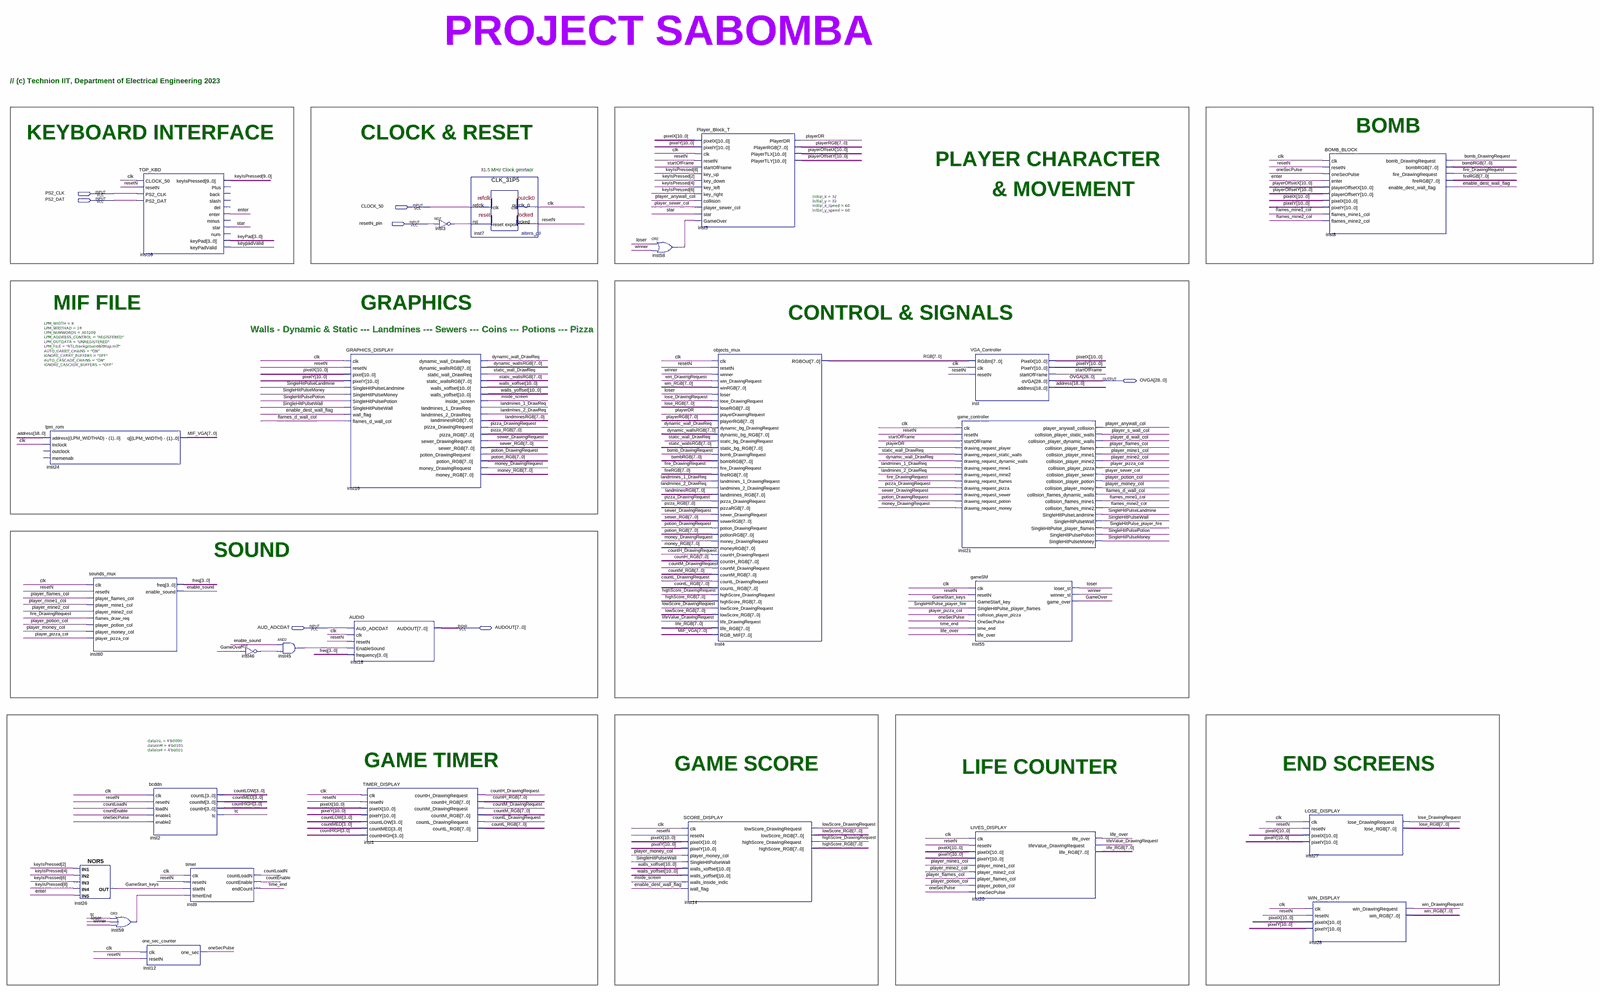
[diagram p0: schematic sheet, whole]
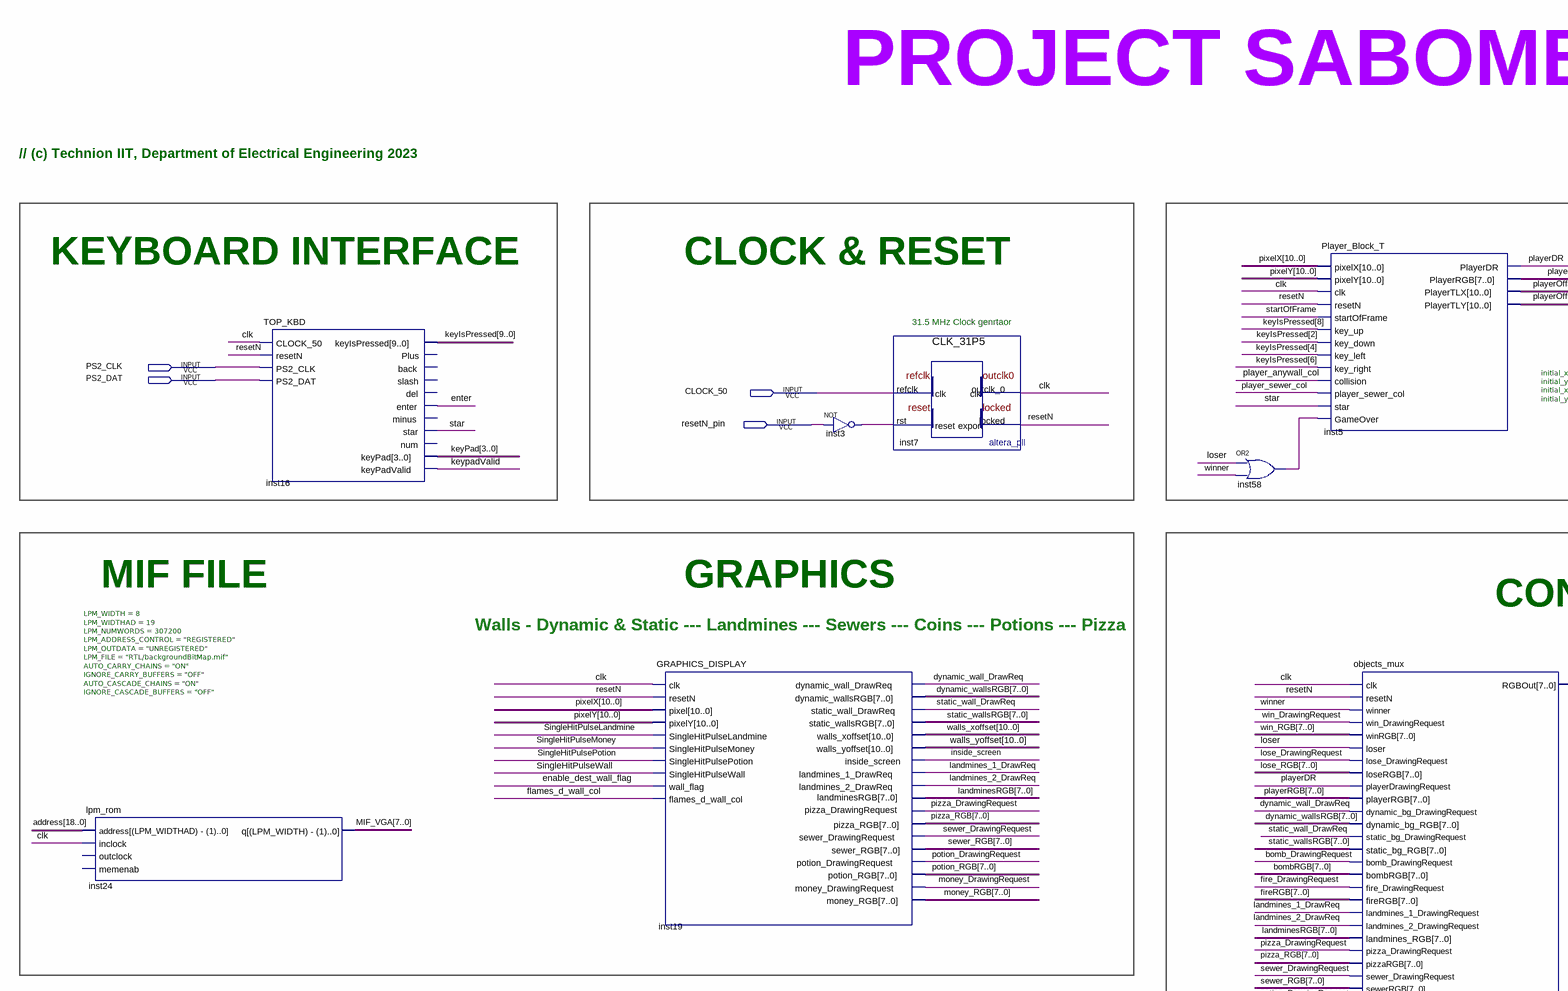
[diagram p1: schematic sheet, upper left part]
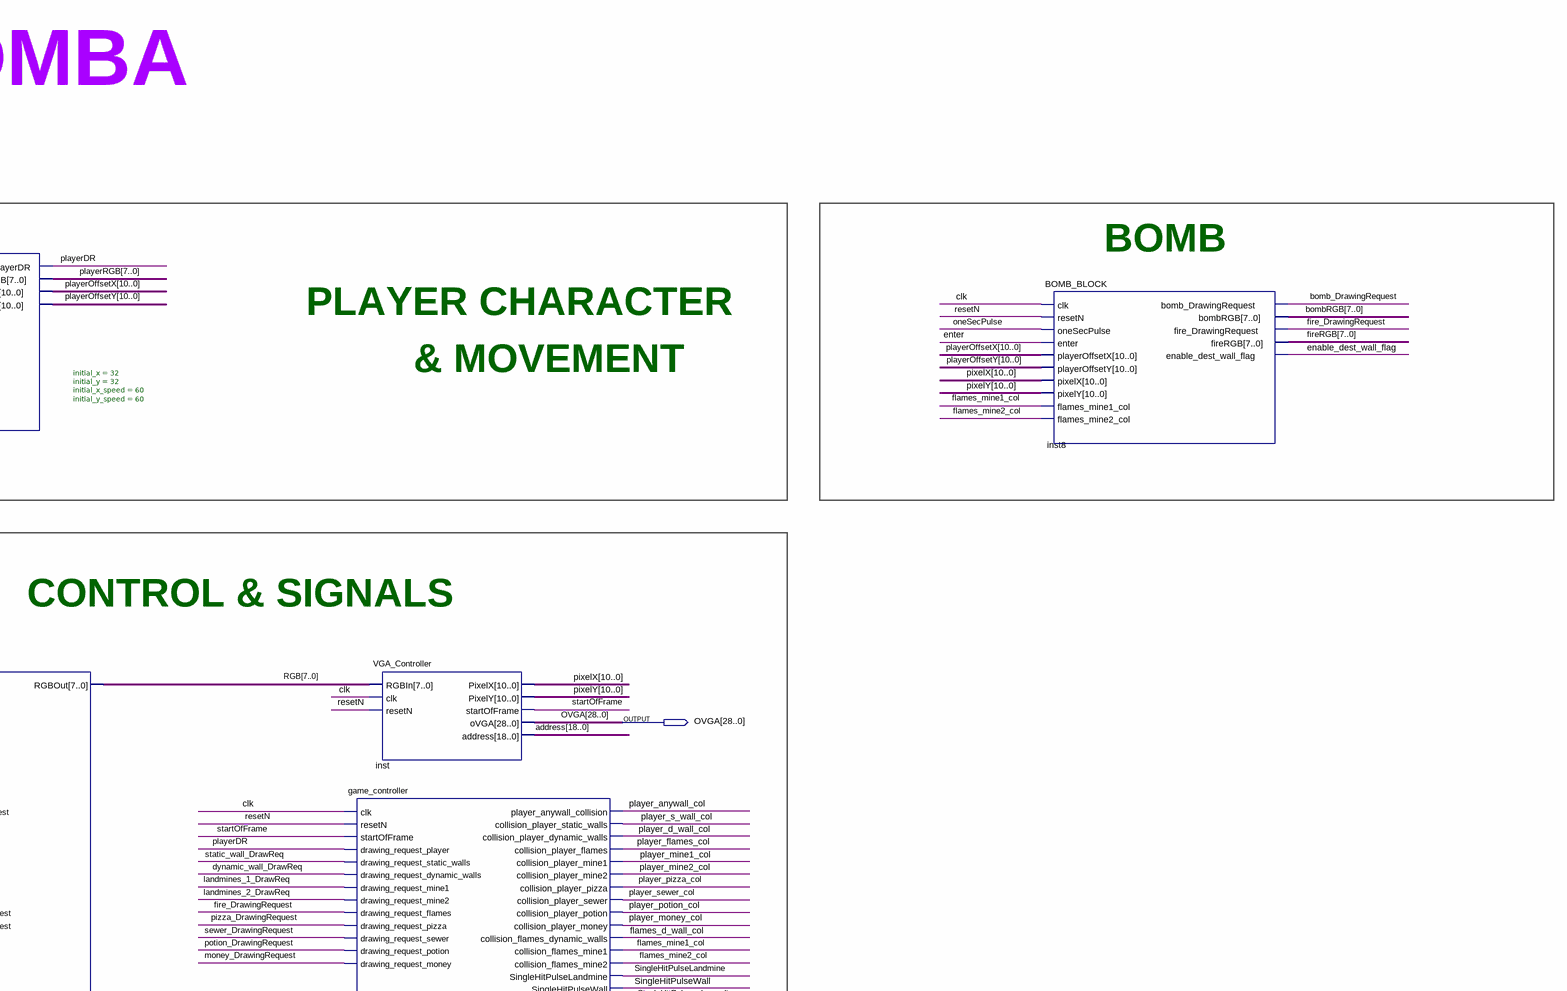
[diagram p2: schematic sheet, upper right part]
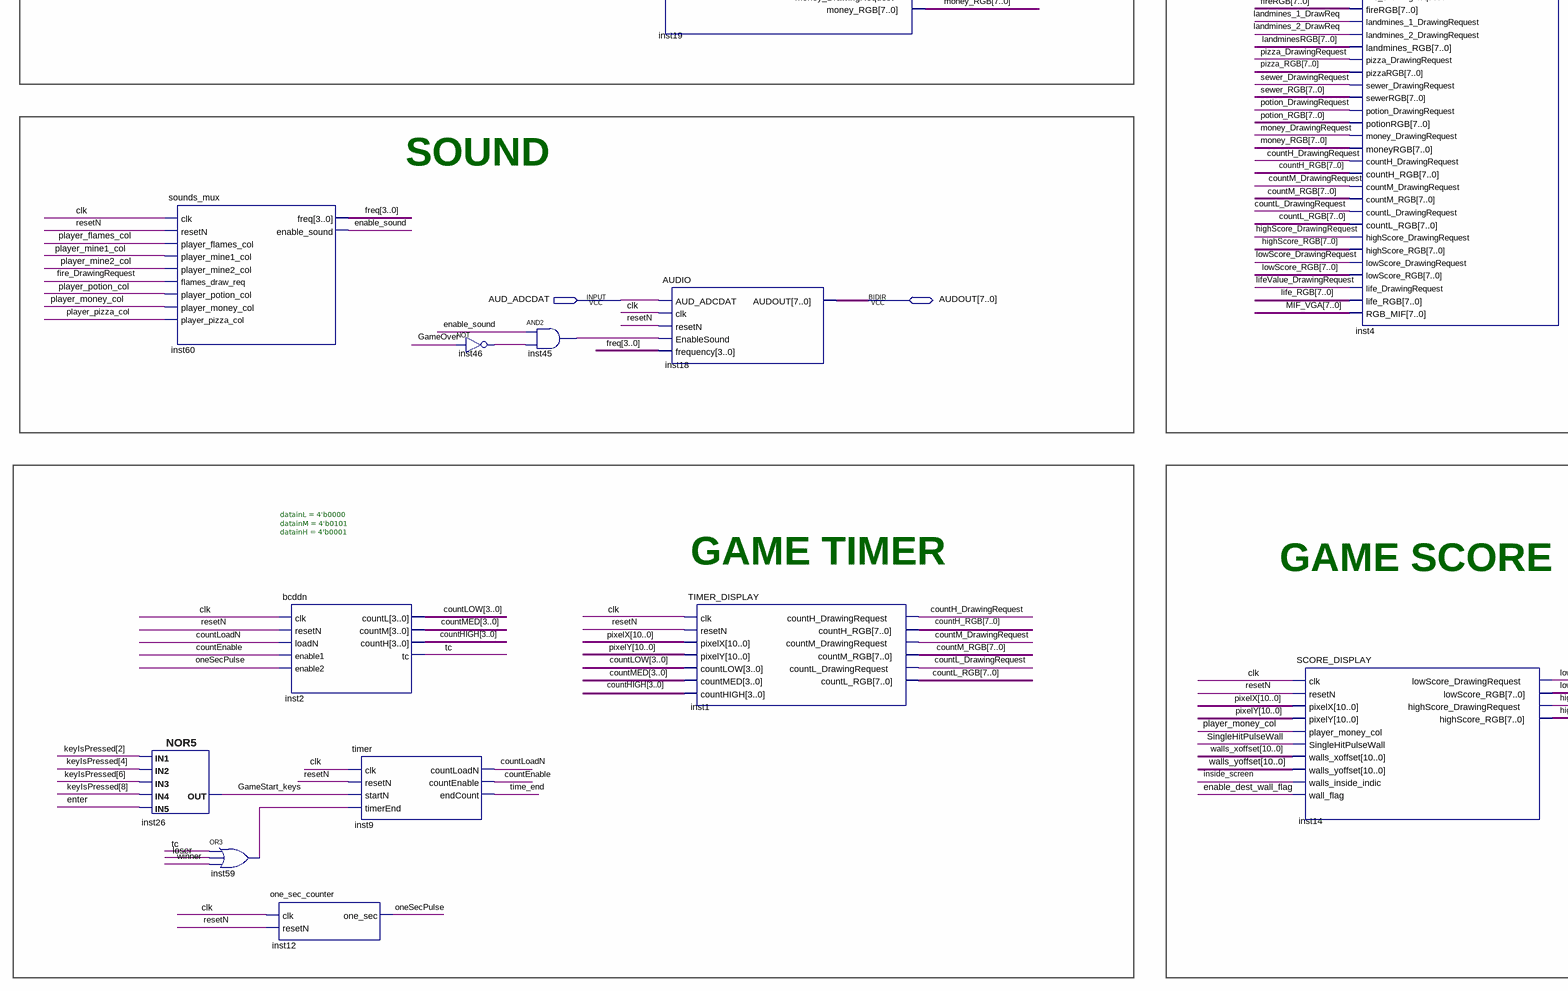
[diagram p3: schematic sheet, lower left part]
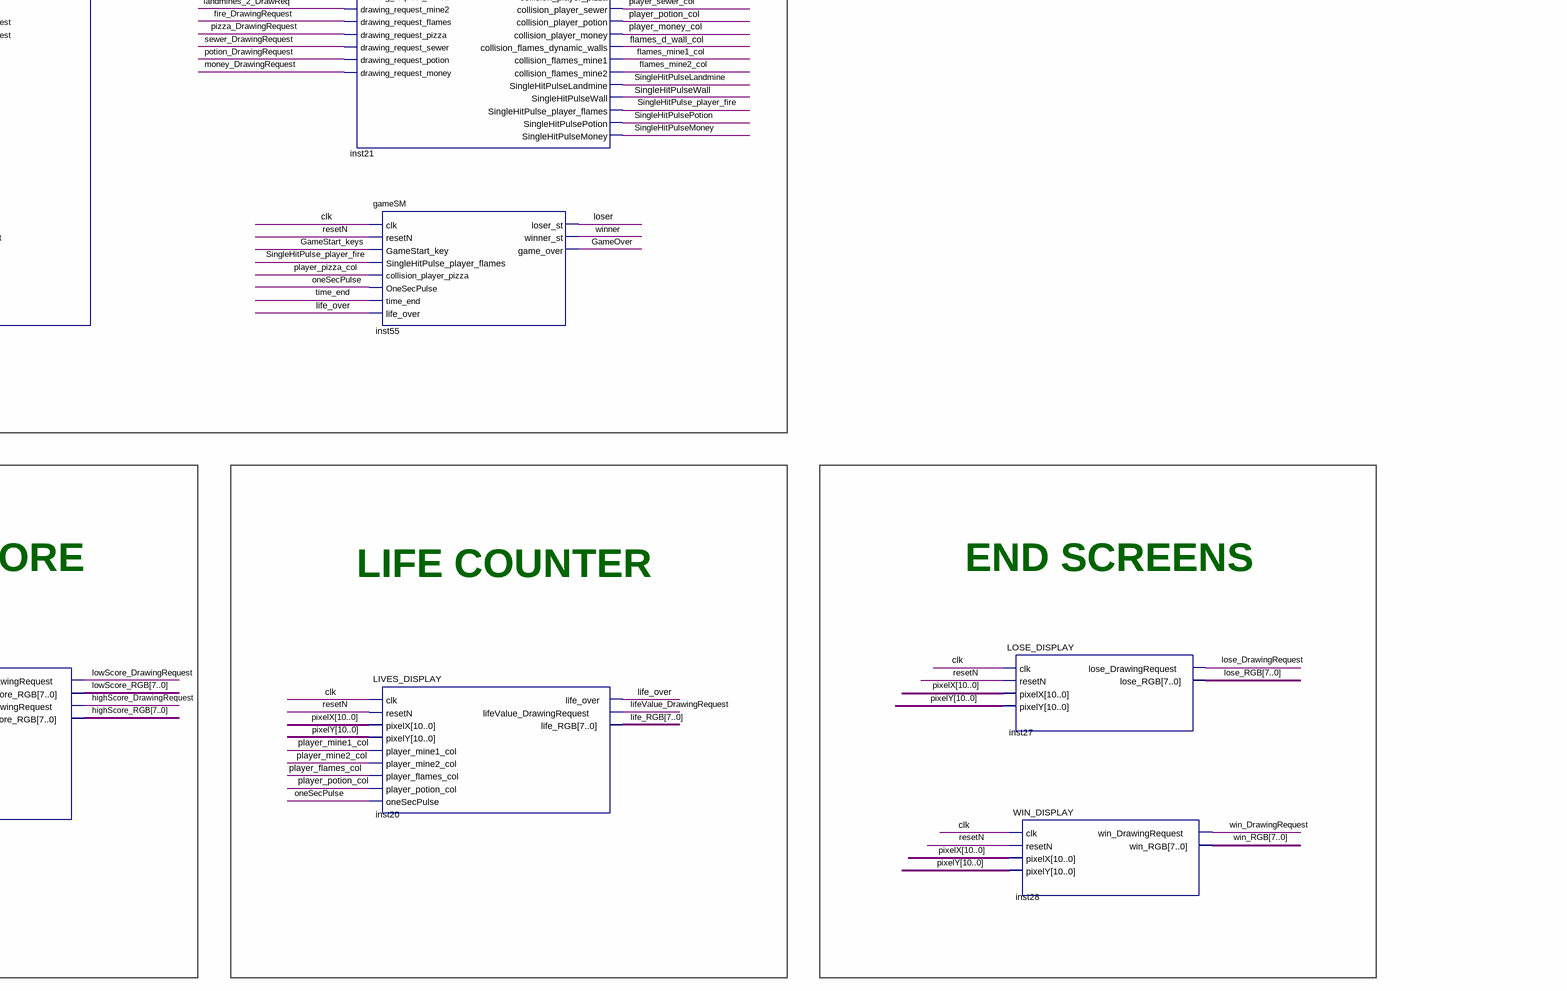
[diagram p4: schematic sheet, lower right part]
// Quartus schematic TOP_VGA_PROJECT_SABOMBA.bdf as structural Verilog: 26 symbols, 7 pins
module TOP_VGA_PROJECT_SABOMBA (
  input  PS2_CLK,
  input  PS2_DAT,
  input  CLOCK_50,
  input  resetN_pin,
  input  AUD_ADCDAT,
  inout  [7:0] AUDOUT,
  output [28:0] OVGA
);

  wire bomb_DrawingRequest, clk, countEnable, countH_DrawingRequest, countL_DrawingRequest, countLoadN,
       countM_DrawingRequest, dynamic_wall_DrawReq, enable_dest_wall_flag, enable_sound, enter,
       fire_DrawingRequest, flames_d_wall_col, flames_mine1_col, flames_mine2_col, GameOver, GameStart_keys,
       highScore_DrawingRequest, inside_screen, inst3_out, inst45_out, inst46_out, inst58_out, inst59_out,
       keypadValid, landmines_1_DrawReq, landmines_2_DrawReq, life_over, lifeValue_DrawingRequest,
       lose_DrawingRequest, loser, lowScore_DrawingRequest, money_DrawingRequest, oneSecPulse,
       pizza_DrawingRequest, player_anywall_col, player_d_wall_col, player_flames_col, player_mine1_col,
       player_mine2_col, player_money_col, player_pizza_col, player_potion_col, player_s_wall_col,
       player_sewer_col, playerDR, potion_DrawingRequest, resetN, sewer_DrawingRequest,
       SingleHitPulse_player_fire, SingleHitPulseLandmine, SingleHitPulseMoney, SingleHitPulsePotion,
       SingleHitPulseWall, star, startOfFrame, static_wall_DrawReq, tc, time_end, win_DrawingRequest, winner;
  wire [3:0] countHIGH, countLOW, countMED, freq, keyPad;
  wire [7:0] bombRGB, countH_RGB, countL_RGB, countM_RGB, dynamic_wallsRGB, fireRGB, highScore_RGB,
       landminesRGB, life_RGB, lose_RGB, lowScore_RGB, MIF_VGA, money_RGB, pizza_RGB, playerRGB, potion_RGB,
       RGB, sewer_RGB, static_wallsRGB, win_RGB;
  wire [9:0] keyIsPressed;
  wire [10:0] pixelX, pixelY, playerOffsetX, playerOffsetY, walls_xoffset, walls_yoffset;
  wire [18:0] address;

  lpm_rom #(.LPM_WIDTH(8), .LPM_WIDTHAD(19), .LPM_NUMWORDS(307200), .LPM_ADDRESS_CONTROL("REGISTERED"), .LPM_OUTDATA("UNREGISTERED"), .LPM_FILE("RTL/backgroundBitMap.mif"), .AUTO_CARRY_CHAINS("ON"), .IGNORE_CARRY_BUFFERS("OFF"), .AUTO_CASCADE_CHAINS("ON"), .IGNORE_CASCADE_BUFFERS("OFF")) inst24 (
    .address(address), .inclock(clk), .q(MIF_VGA));  // open: outclock, memenab
  sounds_mux inst60 (
    .clk(clk), .resetN(resetN), .player_flames_col(player_flames_col), .player_mine1_col(player_mine1_col),
    .player_mine2_col(player_mine2_col), .flames_draw_req(fire_DrawingRequest),
    .player_potion_col(player_potion_col), .player_money_col(player_money_col),
    .player_pizza_col(player_pizza_col), .freq(freq), .enable_sound(enable_sound));
  nor inst26 (GameStart_keys, keyIsPressed[2], keyIsPressed[4], keyIsPressed[6], keyIsPressed[8], enter);
  or inst59 (inst59_out, tc, loser, winner);
  TOP_KBD inst16 (
    .CLOCK_50(clk), .resetN(resetN), .PS2_CLK(PS2_CLK), .PS2_DAT(PS2_DAT), .keyIsPressed(keyIsPressed),
    .enter(enter), .star(star), .keyPad(keyPad), .keyPadValid(keypadValid));  // open: Plus, back, slash, del, minus, num
  bcddn #(.datainL(4'b0000), .datainM(4'b0101), .datainH(4'b0001)) inst2 (
    .clk(clk), .resetN(resetN), .loadN(countLoadN), .enable1(countEnable), .enable2(oneSecPulse),
    .countL(countLOW), .countM(countMED), .countH(countHIGH), .tc(tc));
  one_sec_counter inst12 (.clk(clk), .resetN(resetN), .one_sec(oneSecPulse));
  timer inst9 (
    .clk(clk), .resetN(resetN), .startN(GameStart_keys), .timerEnd(inst59_out), .countLoadN(countLoadN),
    .countEnable(countEnable), .endCount(time_end));
  not inst46 (inst46_out, GameOver);
  and inst45 (inst45_out, enable_sound, inst46_out);
  GRAPHICS_DISPLAY inst19 (
    .clk(clk), .resetN(resetN), .pixel(pixelX), .pixelY(pixelY),
    .SingleHitPulseLandmine(SingleHitPulseLandmine), .SingleHitPulseMoney(SingleHitPulseMoney),
    .SingleHitPulsePotion(SingleHitPulsePotion), .SingleHitPulseWall(SingleHitPulseWall),
    .wall_flag(enable_dest_wall_flag), .flames_d_wall_col(flames_d_wall_col),
    .dynamic_wall_DrawReq(dynamic_wall_DrawReq), .static_wall_DrawReq(static_wall_DrawReq),
    .dynamic_wallsRGB(dynamic_wallsRGB), .static_wallsRGB(static_wallsRGB), .walls_xoffset(walls_xoffset),
    .walls_yoffset(walls_yoffset), .inside_screen(inside_screen), .landmines_1_DrawReq(landmines_1_DrawReq),
    .pizza_DrawingRequest(pizza_DrawingRequest), .landmines_2_DrawReq(landmines_2_DrawReq),
    .pizza_RGB(pizza_RGB), .landminesRGB(landminesRGB), .sewer_DrawingRequest(sewer_DrawingRequest),
    .potion_DrawingRequest(potion_DrawingRequest), .sewer_RGB(sewer_RGB), .potion_RGB(potion_RGB),
    .money_DrawingRequest(money_DrawingRequest), .money_RGB(money_RGB));
  AUDIO inst18 (
    .AUD_ADCDAT(AUD_ADCDAT), .clk(clk), .resetN(resetN), .EnableSound(inst45_out), .frequency(freq),
    .AUDOUT(AUDOUT));
  TIMER_DISPLAY inst1 (
    .clk(clk), .resetN(resetN), .pixelX(pixelX), .pixelY(pixelY), .countLOW(countLOW), .countMED(countMED),
    .countHIGH(countHIGH), .countH_DrawingRequest(countH_DrawingRequest), .countH_RGB(countH_RGB),
    .countM_DrawingRequest(countM_DrawingRequest), .countM_RGB(countM_RGB),
    .countL_DrawingRequest(countL_DrawingRequest), .countL_RGB(countL_RGB));
  not inst3 (inst3_out, resetN_pin);
  CLK_31P5 inst7 (.refclk(CLOCK_50), .rst(inst3_out), .outclk_0(clk), .locked(resetN));
  or inst58 (inst58_out, loser, winner);
  SCORE_DISPLAY inst14 (
    .clk(clk), .resetN(resetN), .pixelX(pixelX), .pixelY(pixelY), .player_money_col(player_money_col),
    .SingleHitPulseWall(SingleHitPulseWall), .walls_xoffset(walls_xoffset), .walls_yoffset(walls_yoffset),
    .walls_inside_indic(inside_screen), .wall_flag(enable_dest_wall_flag),
    .lowScore_DrawingRequest(lowScore_DrawingRequest), .lowScore_RGB(lowScore_RGB),
    .highScore_DrawingRequest(highScore_DrawingRequest), .highScore_RGB(highScore_RGB));
  Player_Block_T #(.initial_x(32), .initial_y(32), .initial_x_speed(60), .initial_y_speed(60)) inst5 (
    .pixelX(pixelX), .pixelY(pixelY), .clk(clk), .resetN(resetN), .startOfFrame(startOfFrame),
    .key_up(keyIsPressed[8]), .key_down(keyIsPressed[2]), .key_left(keyIsPressed[4]),
    .key_right(keyIsPressed[6]), .collision(player_anywall_col), .player_sewer_col(player_sewer_col),
    .star(star), .GameOver(inst58_out), .PlayerDR(playerDR), .PlayerRGB(playerRGB),
    .PlayerTLX(playerOffsetX), .PlayerTLY(playerOffsetY));
  objects_mux inst4 (
    .clk(clk), .resetN(resetN), .winner(winner), .win_DrawingRequest(win_DrawingRequest), .winRGB(win_RGB),
    .loser(loser), .lose_DrawingRequest(lose_DrawingRequest), .loseRGB(lose_RGB),
    .playerDrawingRequest(playerDR), .playerRGB(playerRGB), .dynamic_bg_DrawingRequest(dynamic_wall_DrawReq),
    .dynamic_bg_RGB(dynamic_wallsRGB), .static_bg_DrawingRequest(static_wall_DrawReq),
    .static_bg_RGB(static_wallsRGB), .bomb_DrawingRequest(bomb_DrawingRequest), .bombRGB(bombRGB),
    .fire_DrawingRequest(fire_DrawingRequest), .fireRGB(fireRGB),
    .landmines_1_DrawingRequest(landmines_1_DrawReq), .landmines_2_DrawingRequest(landmines_2_DrawReq),
    .landmines_RGB(landminesRGB), .pizza_DrawingRequest(pizza_DrawingRequest), .pizzaRGB(pizza_RGB),
    .sewer_DrawingRequest(sewer_DrawingRequest), .sewerRGB(sewer_RGB),
    .potion_DrawingRequest(potion_DrawingRequest), .potionRGB(potion_RGB),
    .money_DrawingRequest(money_DrawingRequest), .moneyRGB(money_RGB),
    .countH_DrawingRequest(countH_DrawingRequest), .countH_RGB(countH_RGB),
    .countM_DrawingRequest(countM_DrawingRequest), .countM_RGB(countM_RGB),
    .countL_DrawingRequest(countL_DrawingRequest), .countL_RGB(countL_RGB),
    .highScore_DrawingRequest(highScore_DrawingRequest), .highScore_RGB(highScore_RGB),
    .lowScore_DrawingRequest(lowScore_DrawingRequest), .lowScore_RGB(lowScore_RGB),
    .life_DrawingRequest(lifeValue_DrawingRequest), .life_RGB(life_RGB), .RGB_MIF(MIF_VGA), .RGBOut(RGB));
  VGA_Controller inst (
    .RGBIn(RGB), .clk(clk), .resetN(resetN), .PixelX(pixelX), .PixelY(pixelY), .startOfFrame(startOfFrame),
    .oVGA(OVGA), .address(address));
  game_controller inst21 (
    .clk(clk), .resetN(resetN), .startOfFrame(startOfFrame), .drawing_request_player(playerDR),
    .drawing_request_static_walls(static_wall_DrawReq), .drawing_request_dynamic_walls(dynamic_wall_DrawReq),
    .drawing_request_mine1(landmines_1_DrawReq), .drawing_request_mine2(landmines_2_DrawReq),
    .drawing_request_flames(fire_DrawingRequest), .drawing_request_pizza(pizza_DrawingRequest),
    .drawing_request_sewer(sewer_DrawingRequest), .drawing_request_potion(potion_DrawingRequest),
    .drawing_request_money(money_DrawingRequest), .player_anywall_collision(player_anywall_col),
    .collision_player_static_walls(player_s_wall_col), .collision_player_dynamic_walls(player_d_wall_col),
    .collision_player_flames(player_flames_col), .collision_player_mine1(player_mine1_col),
    .collision_player_mine2(player_mine2_col), .collision_player_pizza(player_pizza_col),
    .collision_player_sewer(player_sewer_col), .collision_player_potion(player_potion_col),
    .collision_player_money(player_money_col), .collision_flames_dynamic_walls(flames_d_wall_col),
    .collision_flames_mine1(flames_mine1_col), .collision_flames_mine2(flames_mine2_col),
    .SingleHitPulseLandmine(SingleHitPulseLandmine), .SingleHitPulseWall(SingleHitPulseWall),
    .SingleHitPulse_player_flames(SingleHitPulse_player_fire), .SingleHitPulsePotion(SingleHitPulsePotion),
    .SingleHitPulseMoney(SingleHitPulseMoney));
  gameSM inst55 (
    .clk(clk), .resetN(resetN), .GameStart_key(GameStart_keys),
    .SingleHitPulse_player_flames(SingleHitPulse_player_fire), .collision_player_pizza(player_pizza_col),
    .OneSecPulse(oneSecPulse), .time_end(time_end), .life_over(life_over), .loser_st(loser),
    .winner_st(winner), .game_over(GameOver));
  LIVES_DISPLAY inst20 (
    .clk(clk), .resetN(resetN), .pixelX(pixelX), .pixelY(pixelY), .player_mine1_col(player_mine1_col),
    .player_mine2_col(player_mine2_col), .player_flames_col(player_flames_col),
    .player_potion_col(player_potion_col), .oneSecPulse(oneSecPulse), .life_over(life_over),
    .lifeValue_DrawingRequest(lifeValue_DrawingRequest), .life_RGB(life_RGB));
  BOMB_BLOCK inst8 (
    .clk(clk), .resetN(resetN), .oneSecPulse(oneSecPulse), .enter(enter), .playerOffsetX(playerOffsetX),
    .playerOffsetY(playerOffsetY), .pixelX(pixelX), .pixelY(pixelY), .flames_mine1_col(flames_mine1_col),
    .flames_mine2_col(flames_mine2_col), .bomb_DrawingRequest(bomb_DrawingRequest), .bombRGB(bombRGB),
    .fire_DrawingRequest(fire_DrawingRequest), .fireRGB(fireRGB),
    .enable_dest_wall_flag(enable_dest_wall_flag));
  LOSE_DISPLAY inst27 (
    .clk(clk), .resetN(resetN), .pixelX(pixelX), .pixelY(pixelY), .lose_DrawingRequest(lose_DrawingRequest),
    .lose_RGB(lose_RGB));
  WIN_DISPLAY inst28 (
    .clk(clk), .resetN(resetN), .pixelX(pixelX), .pixelY(pixelY), .win_DrawingRequest(win_DrawingRequest),
    .win_RGB(win_RGB));

  // Notes on the sheet:
  //   PROJECT SABOMBA
  //   // (c) Technion IIT, Department of Electrical Engineering 2023
  //   BOMB
  //   KEYBOARD INTERFACE
  //   CLOCK & RESET
  //   PLAYER CHARACTER
  //   31.5 MHz Clock genrtaor
  //   & MOVEMENT
  //   MIF FILE
  //   GRAPHICS
  //   CONTROL & SIGNALS
  //   Walls - Dynamic & Static --- Landmines --- Sewers --- Coins --- Potions --- Pizza
  //   SOUND
  //   GAME TIMER
  //   GAME SCORE
  //   END SCREENS
  //   LIFE COUNTER
endmodule
